# EAGLE design ML_Interface_A (EAGLE 9.2.2)
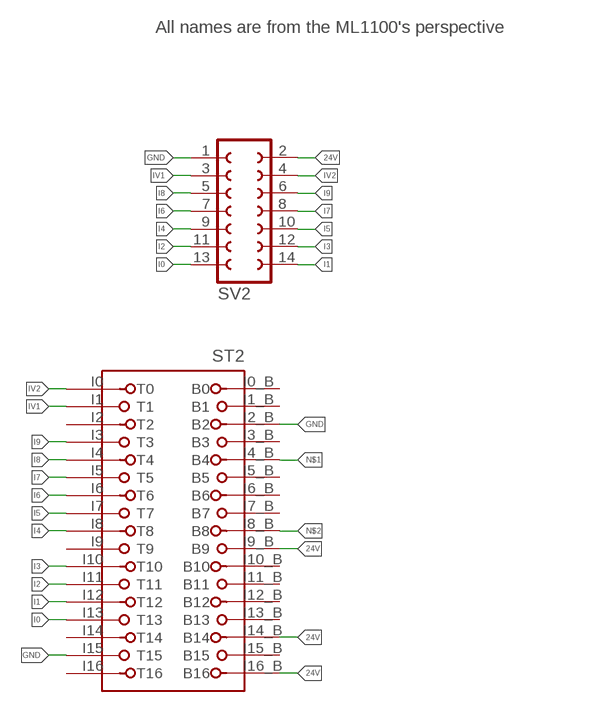
[diagram p0: schematic, sheet 1]

## Parts
ST2  ML1100_17_PIN  [ML1100_17_PIN]
SV2  FE07-2W  [FE07-2W]

## Nets
24V: ST2.I9_B(B9) ST2.I14_B(B14) ST2.I16_B(B16) SV2.2
GND: ST2.I2_B(B2) ST2.I15(T15) SV2.1
I0: ST2.I13(T13) SV2.13
I1: ST2.I12(T12) SV2.14
I2: ST2.I11(T11) SV2.11
I3: ST2.I10(T10) SV2.12
I4: ST2.I8(T8) SV2.9
I5: ST2.I7(T7) SV2.10
I6: ST2.I6(T6) SV2.7
I7: ST2.I5(T5) SV2.8
I8: ST2.I4(T4) SV2.5
I9: ST2.I3(T3) SV2.6
IV1: ST2.I1(T1) SV2.3
IV2: ST2.I0(T0) SV2.4
N$1: ST2.I4_B(B4)
N$2: ST2.I8_B(B8)
Unconnected: ST2.I1_B(B1) ST2.I2(T2) ST2.I3_B(B3) ST2.I5_B(B5) ST2.I6_B(B6) ST2.I7_B(B7) ST2.I9(T9) ST2.I10_B(B10) ST2.I11_B(B11) ST2.I12_B(B12) ST2.I15_B(B15)

## Notes on the sheet
- All names are from the ML1100's perspective

## Power pins joined to a net without a drawn wire
B0: ST2.I0_B(B0)
B13: ST2.I13_B(B13)
T14: ST2.I14(T14)
T16: ST2.I16(T16)

## Library data of the parts
ST2 = EdgCon_V1:ML1100_17_PIN: 8-bit CARD IBM/PC-AT
SV2 = con-lsta:FE07-2W: FEMALE HEADER; OC_FARNELL: unknown; OC_NEWARK: unknown

## Net classes
0 default: width 0.203 mm
1 ground: width 0.61 mm
2 signal_out: width 0.254 mm, clearance 0.152 mm

## Board
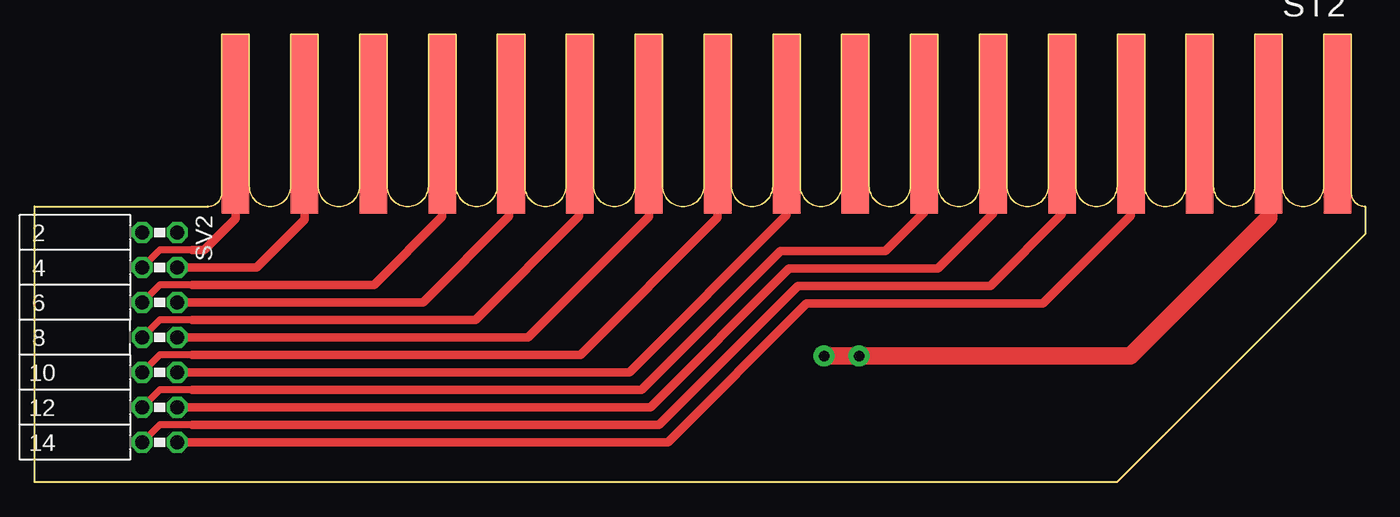
[diagram p1: board, top side]
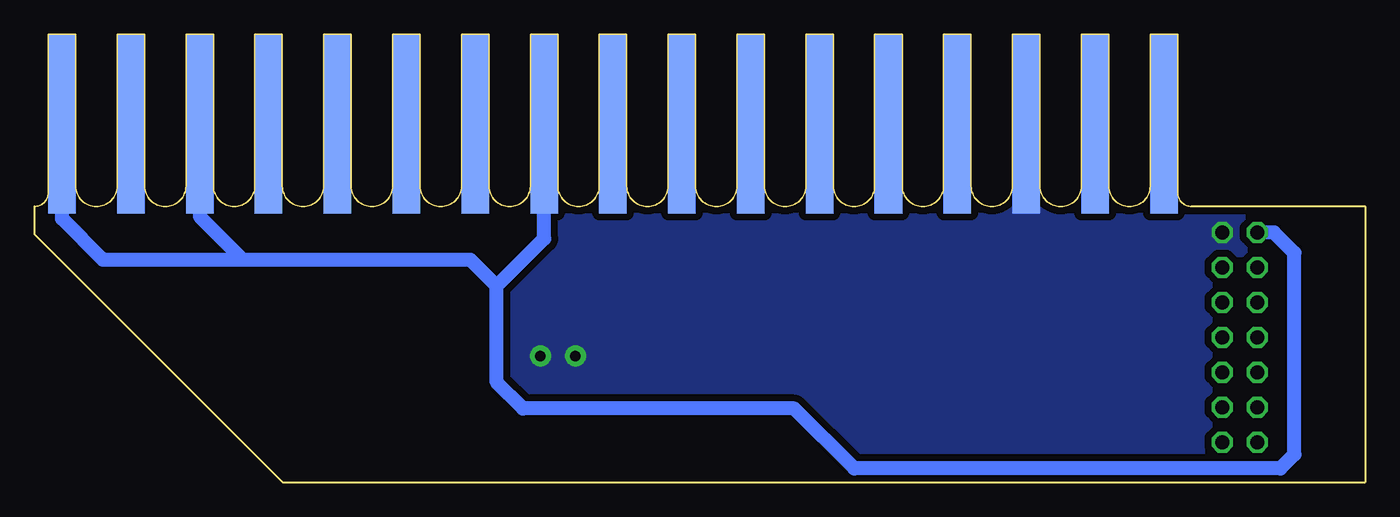
[diagram p2: board, bottom side, seen from below]

Size 96.6 x 32.52 mm. Coordinates in mm from the lower left corner, seen from the top.
Outline: 12.6,20.02 0,20.02 0,0 78.58,0 96.6,18.02 96.6,20.02
Copper layers (1*16): Top 0.035mm / dielectric 1.5mm / Bottom 0.035mm
Design rules "default *": minimum track width 10mil, minimum drill 0.35mm, track to track 10mil, track to pad 10mil, pad to pad 10mil, via to via 10mil, smd to smd 10mil, copper to edge 1mil, drill to drill 6mil, minimum pad ring 10mil, minimum via ring 8mil, stop-mask expansion 4mil, vias tented up to drill 0mil, thermal gap 10mil

### Footprints (pad centres in the part's own frame; a part is rotated, then mirrored left to right if it is on the bottom)
ML1100_17_PIN = smd 2 x 13: I0 81,6.5; I1 76,6.5; I2 71,6.5; I3 66,6.5; I4 61,6.5; I5 56,6.5; I6 51,6.5; I7 46,6.5; I8 41,6.5; I9 36,6.5; I10 31,6.5; I11 26,6.5; I12 21,6.5; I13 16,6.5; I14 11,6.5; I15 6,6.5; I16 1,6.5 | smd 2 x 13 bottom: I0_B 81,6.5; I1_B 76,6.5; I2_B 71,6.5; I3_B 66,6.5; I4_B 61,6.5; I5_B 56,6.5; I6_B 51,6.5; I7_B 46,6.5; I8_B 41,6.5; I9_B 36,6.5; I10_B 31,6.5; I11_B 26,6.5; I12_B 21,6.5; I13_B 16,6.5; I14_B 11,6.5; I15_B 6,6.5; I16_B 1,6.5
FE07-2W = drill 1.016 octagon: 1 -7.62,1.27; 2 -7.62,-1.27; 3 -5.08,1.27; 4 -5.08,-1.27; 5 -2.54,1.27; 6 -2.54,-1.27; 7 0,1.27; 8 0,-1.27; 9 2.54,1.27; 10 2.54,-1.27; 11 5.08,1.27; 12 5.08,-1.27; 13 7.62,1.27; 14 7.62,-1.27

### Placement (x,y rotation side)
ST2  95.6,32.52 180 top
SV2  9.1,10.52 270 top

### Tracks (layer width: path | path; a pad name or v marks a point on that pad's centre or on a via)
24V
  Bottom 1.016: 63.04,14.24 63.04,7.26 61.13,5.35 41.45,5.35 37.08,0.98 6.14,0.98 5.13,2 5.13,16.65 6.61,18.14 7.82,18.14 SV2.2 | 63.04,14.24 64.95,16.15 81.45,16.15 | 81.45,16.15 91.62,16.15 94.6,19.13 ST2.I16_B | 63.04,14.24 59.6,17.68 ST2.I9_B | ST2.I14_B 84.6,19.29 81.45,16.15
GND  (via drill 0.76 pad 1.52)
  Top 1.27: ST2.I15 89.6,19.21 79.55,9.16 v59.86,9.16 v57.32,9.16
  pour Bottom (isolate 0.5, no thermals): -1.1,20.21 96.57,20.21 96.57,-0.11 -1.1,-0.11
I0
  Top 0.61: ST2.I13 79.6,19.37 73.2,12.97 56.05,12.97 45.98,2.9 10.39,2.9 SV2.13
I1
  Top 0.508: 11.44,4.17 9.1,4.17 SV2.14
  Top 0.61: 11.44,4.17 45.34,4.17 55.42,14.24 69.39,14.24 74.6,19.45 ST2.I12
I2
  Top 0.61: ST2.I11 69.6,19.53 65.58,15.51 54.78,15.51 44.71,5.44 10.39,5.44 SV2.11
I3
  Top 0.508: 11.44,6.71 9.1,6.71 SV2.12
  Top 0.61: 11.44,6.71 44.07,6.71 54.15,16.78 61.77,16.78 64.6,19.61 ST2.I10
I4
  Top 0.61: ST2.I8 54.6,19.39 43.19,7.98 10.39,7.98 SV2.9
I5
  Top 0.508: 11.44,9.25 9.1,9.25 SV2.10
  Top 0.61: ST2.I7 49.6,19.22 39.63,9.25 11.44,9.25
I6
  Top 0.61: SV2.7 35.82,10.52 44.6,19.3 ST2.I6
I7
  Top 0.508: 11.44,11.79 9.1,11.79 SV2.8
  Top 0.61: 11.44,11.79 32.01,11.79 39.54,19.32 39.54,25.96 ST2.I5
I8
  Top 0.61: ST2.I4 34.46,25.88 34.46,19.32 28.2,13.06 10.39,13.06 SV2.5
I9
  Top 0.508: 11.44,14.33 9.1,14.33 SV2.6
  Top 0.61: 11.44,14.33 24.64,14.33 29.6,19.28 ST2.I3
IV1
  Top 0.61: ST2.I1 19.6,19.06 16.13,15.6 10.39,15.6 SV2.3
IV2
  Top 0.508: 11.44,16.87 9.1,16.87 SV2.4
  Top 0.61: ST2.I0 14.6,19.14 12.32,16.87 11.44,16.87

### Text on the board
tPlace: Dist between boards: 91 mm